# Altium schematic sheet bluetooth.SchDoc
size A4; SheetNumber: 4; SheetTotal: 8
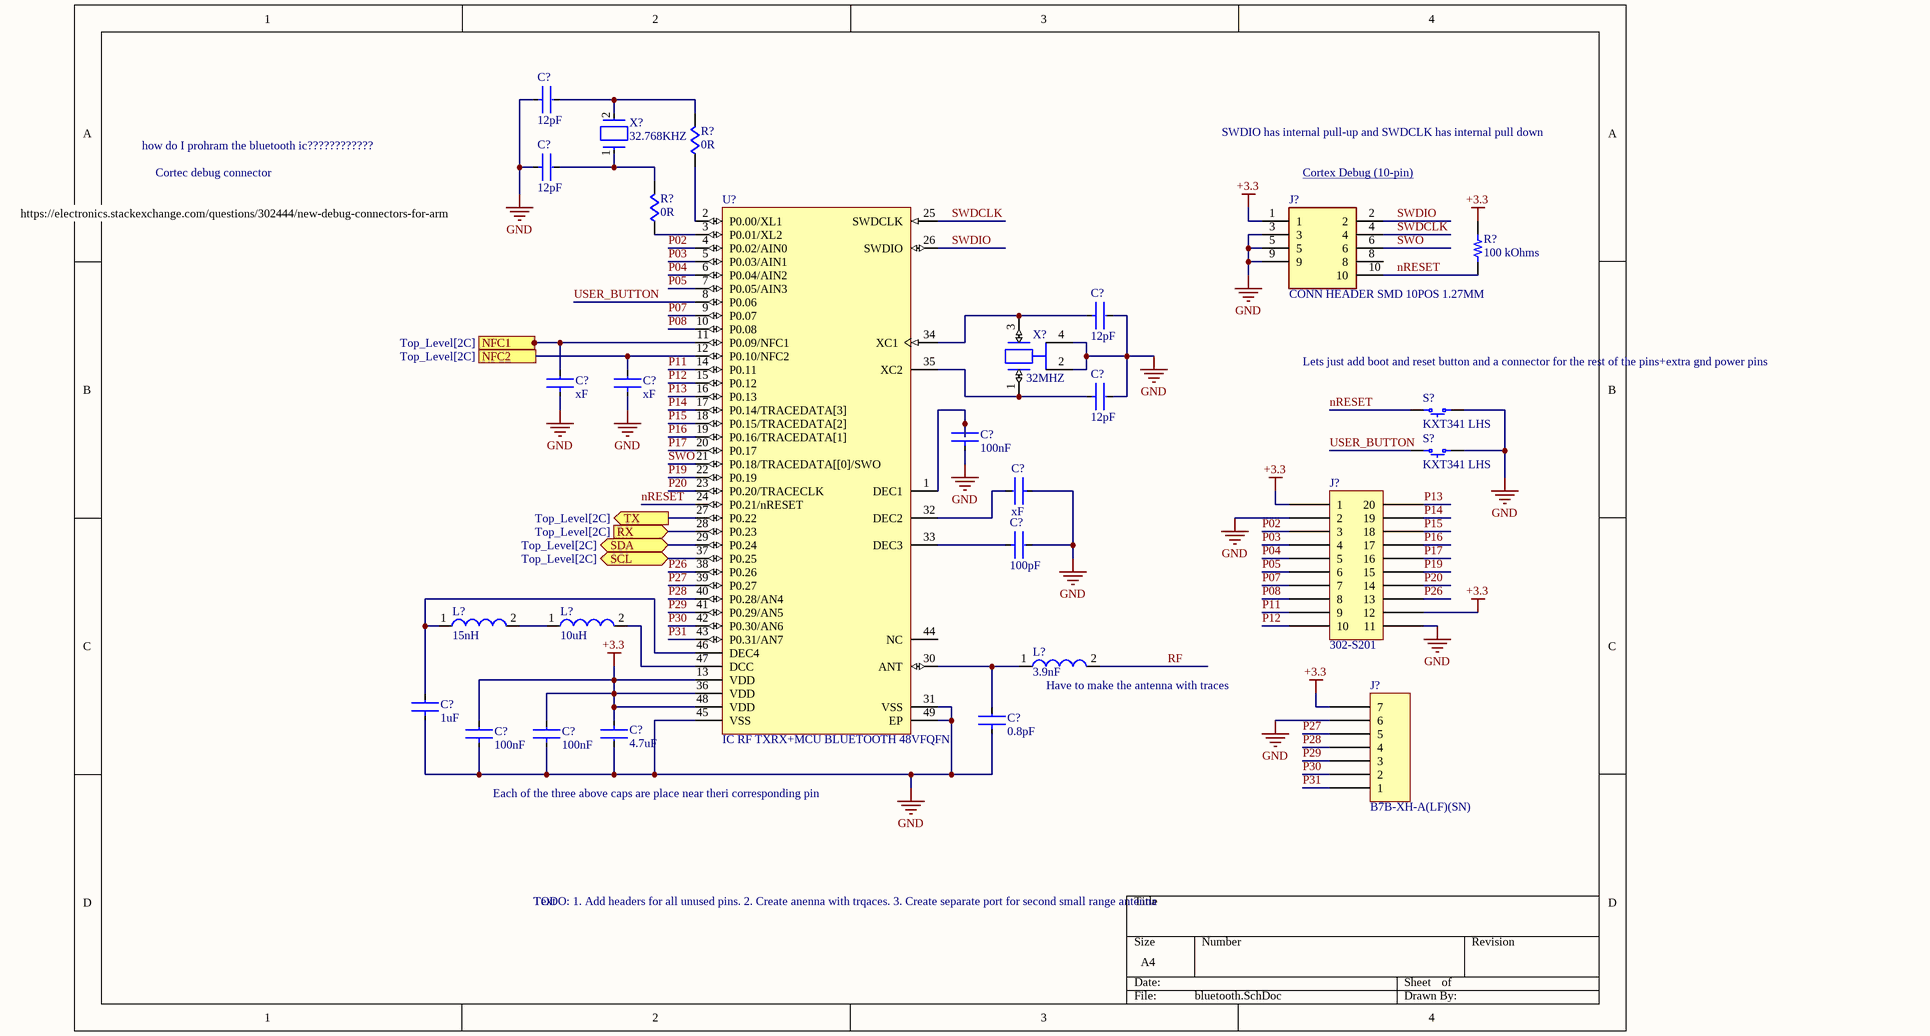
[diagram p0: bluetooth.SchDoc]

## Parts
(Parts that share a designator on the sheet are numbered #1, #2 ... from top to bottom, then left to right.)
C?#1  value 12pF  [FP-GCM155-0_05-IPC_C]  (hidden comment: NPO, +-2%)
C?#2  value 12pF  [FP-GCM155-0_05-IPC_C]  (hidden comment: NPO, +-2%)
C?#3  value 12pF  [FP-GCM155-0_05-IPC_C]  (hidden comment: NPO, +-2%)
C?#4  value xF  [FP-GCM155-0_05-IPC_C]  (hidden comment: tune)
C?#5  value xF  [FP-GCM155-0_05-IPC_C]  (hidden comment: tune)
C?#6  value 12pF  [FP-GCM155-0_05-IPC_C]  (hidden comment: NPO, +-2%)
C?#7  value 100nF  [FP-GCM155-0_05-IPC_C]  (hidden comment: X7R, +-10%)
C?#8  value xF  [FP-GCM155-0_05-IPC_C]  (hidden comment: tune)
C?#9  value 100pF  [FP-GCM155-0_05-IPC_C]  (hidden comment: NP0, +-5%)
C?#10  value 1uF  [FP-CGA3E-0_3-0_1-IPC_C]  (hidden comment: X7R, +-10%)
C?#11  value 0.8pF  [FP-GCM155-0_05-IPC_C]  (hidden comment: NP0, +-5%)
C?#12  value 100nF  [FP-GCM155-0_05-IPC_C]  (hidden comment: X7R, +-10%)
C?#13  value 100nF  [FP-GCM155-0_05-IPC_C]  (hidden comment: X7R, +-10%)
C?#14  value 4.7uF  [FP-CGA3E-0_3-0_1-IPC_C]  (hidden comment: X5R, +-10%)
J?#1  CONN HEADER SMD 10POS 1.27MM  [FTSH10501LDV007K]
J?#2  302-S201  [OST 302-S201]
J?#3  B7B-XH-A(LF)(SN)  [JST XH B7B-XH-A]
L?#1  value 15nH  [FP-LBMF1608-0_8-0_2-IPC_C]  (hidden comment: FIXED IND 15NH 500MA 500MOHM SMD)
L?#2  value 10uH  [FP-MLZ1608-IPC_C]  (hidden comment: FIXED IND 10UH 300MA 600MOHM SMD)
L?#3  value 3.9nF  (hidden comment: FIXED IND 3.9NH 200MA 750MOHM SM)
R?#1  value 0R  [FP-RK73Z1J-IPC_C]  (hidden comment: RES 0 OHM JUMPER 0603)
R?#2  value 0R  [FP-RK73Z1J-IPC_C]  (hidden comment: RES 0 OHM JUMPER 0603)
R?#3  100 kOhms  [RES 0402_1005]
S?#1  KXT341 LHS  [C&K KXT3]
S?#2  KXT341 LHS  [C&K KXT3]
U?  IC RF TXRX+MCU BLUETOOTH 48VFQFN
X?#1  value 32.768KHZ  [FP-ECX-34Q-MFG]  (hidden comment: ECS-.327-9-34QCS-TR)
X?#2  value 32MHZ  [FP-ECS-320-8-37CKM-MFG]  (hidden comment: CRYSTAL 32.0000MHZ 8PF SMD)

## Ports
NFC1 (see Top_Level[2C]), NFC2 (see Top_Level[2C]), RX (in, see Top_Level[2C]), SCL (bidir, see Top_Level[2C]), SDA (bidir, see Top_Level[2C]), TX (out, see Top_Level[2C])

## Nets
+3.3: C?#12.2 C?#13.2 C?#14.1 J?#1.1 J?#2.1 J?#2.12 J?#3.7 R?#3.2 U?.13(VDD) U?.36(VDD) U?.48(VDD)
GND: C?#1.1 C?#2.1 C?#3.2 C?#4.1 C?#5.1 C?#6.2 C?#7.1 C?#8.1 C?#9.2 C?#10.1 C?#11.1 C?#12.1 C?#13.1 C?#14.2 J?#1.3 J?#1.5 J?#1.9 J?#2.2 J?#2.11 J?#3.6 S?#1.1 S?#2.1 U?.31(VSS) U?.45(VSS) U?.49(EP) X?#2.2(Gnd) X?#2.4(Gnd)
NFC1: C?#4.2 U?.11(P0.09/NFC1) ; port NFC1
NFC2: C?#5.2 U?.12(P0.10/NFC2) ; port NFC2
nRESET: J?#1.10 R?#3.1 S?#1.2 U?.24(P0.21/nRESET)
P02: J?#2.3 U?.4(P0.02/AIN0)
P03: J?#2.4 U?.5(P0.03/AIN1)
P04: J?#2.5 U?.6(P0.04/AIN2)
P05: J?#2.6 U?.7(P0.05/AIN3)
P07: J?#2.7 U?.9(P0.07)
P08: J?#2.8 U?.10(P0.08)
P11: J?#2.9 U?.14(P0.11)
P12: J?#2.10 U?.15(P0.12)
P13: J?#2.20 U?.16(P0.13)
P14: J?#2.19 U?.17(P0.14/TRACEDATA[3])
P15: J?#2.18 U?.18(P0.15/TRACEDATA[2])
P16: J?#2.17 U?.19(P0.16/TRACEDATA[1])
P17: J?#2.16 U?.20(P0.17)
P19: J?#2.15 U?.22(P0.19)
P20: J?#2.14 U?.23(P0.20/TRACECLK)
P26: J?#2.13 U?.38(P0.26)
P27: J?#3.5 U?.39(P0.27)
P28: J?#3.4 U?.40(P0.28/AN4)
P29: J?#3.3 U?.41(P0.29/AN5)
P30: J?#3.2 U?.42(P0.30/AN6)
P31: J?#3.1 U?.43(P0.31/AN7)
RF: L?#3.2
RX: U?.28(P0.23) ; port RX
SCL: U?.37(P0.25) ; port SCL
SDA: U?.29(P0.24) ; port SDA
SWDCLK: J?#1.4 U?.25(SWDCLK)
SWDIO: J?#1.2 U?.26(SWDIO)
SWO: J?#1.6 U?.21(P0.18/TRACEDATA[[0]/SWO)
TX: U?.27(P0.22) ; port TX
USER_BUTTON: S?#2.2 U?.8(P0.06)
NetC?#1_2: C?#1.2 R?#1.2 X?#1.2(Out/In)
NetC?#2_2: C?#2.2 R?#2.2 X?#1.1(In/Out)
NetC?#3_1: C?#3.1 U?.34(XC1) X?#2.3(Out/In)
NetC?#6_1: C?#6.1 U?.35(XC2) X?#2.1(In/Out)
NetC?#7_2: C?#7.2 U?.1(DEC1)
NetC?#8_2: C?#8.2 U?.32(DEC2)
NetC?#9_1: C?#9.1 U?.33(DEC3)
NetC?#10_2: C?#10.2 L?#1.1 U?.46(DEC4)
NetC?#11_2: C?#11.2 L?#3.1 U?.30(ANT)
NetL?#1_2: L?#1.2 L?#2.1
NetL?#2_2: L?#2.2 U?.47(DCC)
NetR?#1_1: R?#1.1 U?.2(P0.00/XL1)
NetR?#2_1: R?#2.1 U?.3(P0.01/XL2)

Not connected (* = marked no-connect by the designer): J?#1 8; U? 44(NC)

## Notes on the sheet
- how do I prohram the bluetooth ic????????????
- Cortec debug connector
- SWDIO has internal pull-up and SWDCLK has internal pull down
- (near J?#1) Cortex Debug (10-pin) <https://developer.arm.com/documentation/101416/0100/Hardware-Description/Target-Interfaces/Cortex-Debug--10-pin->
- https://electronics.stackexchange.com/questions/302444/new-debug-connectors-for-arm
- (near S?#1) Lets just add boot and reset button and a connector for the rest of the pins+extra gnd power pins
- (near L?#3) Have to make the antenna with traces
- (near C?#14) Each of the three above caps are place near theri corresponding pin
- Text
- TODO: 1. Add headers for all unused pins. 2. Create anenna with trqaces. 3. Create separate port for second small range antenna

## Library data of the parts
C?#1-C?#9 C?#11-C?#13 = CAP 0402
C?#10 C?#14 = CAP 0603
J?#1 = FTSH-105-01-L-DV-007-K
J?#2 = 302-S201: CONN HEADER VERT 20POS 2.54MM; Manufacturer: On Shore Technology Inc.; Contact Length - Post: 0.122" (3.10mm); Current Rating (Amps): 3A; Material Flammability Rating: UL94 V-0; Number of Positions: 20; Number of Positions Loaded: All; Pitch - Mating: 0.100" (2.54mm); Shrouding: Shrouded - 4 Wall; Style: Board to Cable/Wire; Part Number: 302-S201; ComponentLink1Description: Datasheet; ComponentLink1URL: http://www.on-shore.com/wp-content/uploads/2018/04/302-SXX1.pdf; ComponentLink2Description: DigiKey Link; ComponentLink2URL: https://www.digikey.com/en/products/detail/on-shore-technology-inc/302-S201/2794235; Connector Type: Header; Contact Finish - Mating: Gold; Contact Finish - Post: Gold; Contact Finish Thickness - Mating: Flash; Contact Material: Brass; Contact Shape: Square; Contact Type: Male Pin; Fastening Type: Push-Pull; Features: Keying Slot; Insulation Color: Black; Insulation Height: 0.358" (9.10mm); Insulation Material: Polyester, Glass Filled; LastUpdated: 2022-08-14 5:03:46 PM; Lifecycle Status: Active; Minimum Order: 1; Mounting Type: Through Hole; Number of Rows: 2; Operating Temperature: -40°C ~ 105°C; Packaging: Tray; PartId: 155; Part Status: Active; Price: 0.19; Row Spacing - Mating: 0.100" (2.54mm); Series: 302; Supplier 1: DigiKey; Supplier Part Number 1: ED10524-ND; Termination: Solder
J?#3 = B7B-XH-A(LF)(SN): CONN HEADER VERT 7POS 2.5MM; Manufacturer: JST Sales America Inc.; Contact Length - Post: 0.134" (3.40mm); Current Rating (Amps): 3A; Material Flammability Rating: UL94 V-0; Number of Positions: 7; Number of Positions Loaded: All; Pitch - Mating: 0.098" (2.50mm); Shrouding: Shrouded - 4 Wall; Style: Board to Cable/Wire; Voltage Rating: 250V; Part Number: B7B-XH-A(LF)(SN); ComponentLink1Description: Datasheet; ComponentLink1URL: http://www.jst-mfg.com/product/pdf/eng/eXH.pdf; ComponentLink2Description: DigiKey Link; ComponentLink2URL: http://digikey.com/product-detail/en/jst-sales-america-inc/B7B-XH-A-LF-SN/455-2252-ND/1651050; Connector Type: Header; Contact Finish - Mating: Tin; Contact Finish - Post: Tin; Contact Material: Brass; Contact Shape: Square; Contact Type: Male Pin; Fastening Type: Detent Lock; Insulation Color: Natural; Insulation Height: 0.276" (7.00mm); Insulation Material: Polyamide (PA66), Nylon 6/6; LastUpdated: 2020-01-12 11:47:09 PM; Lifecycle Status: Active; Minimum Order: 1; Mounting Type: Through Hole; Number of Rows: 1; Operating Temperature: -25°C ~ 85°C; Packaging: Bulk; PartId: 72; Part Status: Active; Price: 0.33; Series: XH; Supplier 1: DigiKey; Supplier Part Number 1: 455-2252-ND; Termination: Press-Fit, Solder
L?#1 = 744786115A: Manufacturer: Wurth Electronics; Core Material: Ceramic; Inductance Tolerance: 5%; Shielding: Unshielded; DC Resistance (DCR): 500mR; Self Resonant Frequency: 2.3GHz; Test Frequency: 100MHz; Supplier: Digi-Key; Supplier Part Number: 732-6265-1-ND; Manufacturer Part Number: 744786115A; RoHS: Yes; Category: Fixed Inductors; Stock: 34669; Pricing: 1=0.21, 50=0.197, 100=0.185, 500=0.167, 1000=0.143, 2000=0.113 (USD); Mounting Technology: Surface Mount; Case/Package: 0603; Case Code (Metric): 1608; Case Code (Imperial): 0603; Min Operating Temperature: -55°C; Max Operating Temperature: 125°C; Packaging: Cut Tape; Current Rating: 500mA; Max DC Current: 500mA; Tolerance: 5%; Series: WE-MK; Length: 0.063inch; Width: 0.031inch; Height - Seated (Max): 0.037inch; RoHS Compliant: Yes; Reach SVHC Compliant: Unknown; ComponentLink1URL: http://www.farnell.com/datasheets/1818771.pdf?src-supplier=Farnell; ComponentLink1Description: http://www.farnell.com/datasheets/1818771.pdf?src-supplier=Farnell; ComponentLink2URL: http://www.farnell.com/datasheets/1818771.pdf?src-supplier=Element14; ComponentLink2Description: http://www.farnell.com/datasheets/1818771.pdf?src-supplier=Element14; ComponentLink3URL: https://katalog.we-online.de/pbs/datasheet/744786115A.pdf?src-supplier=Digi-Key; ComponentLink3Description: https://katalog.we-online.de/pbs/datasheet/744786115A.pdf?src-supplier=Digi-Key
L?#2 = MLZ1608N100LTD25: Manufacturer: TDK; Inductor Type: GENERAL PURPOSE INDUCTOR; Supplier: Digi-Key; Supplier Part Number: 445-17067-1-ND; Manufacturer Part Number: MLZ1608N100LTD25; RoHS: Yes; Category: Fixed Inductors; Stock: 118754; Pricing: 1=0.2, 10=0.177, 25=0.1576, 50=0.134, 100=0.1182, 250=0.10832, 500=0.09848, 1000=0.08272 (USD); Reach SVHC Compliant: Yes; RoHS Compliant: Yes; ComponentLink1URL: https://datasheet.ciiva.com:443/pdfs/VipMasterIC/IC/TDKC/TDKC-S-A0007713921/TDKC-S-A0007713921-1.pdf?src-supplier=IHS+Markit; ComponentLink1Description: https://datasheet.ciiva.com:443/pdfs/VipMasterIC/IC/TDKC/TDKC-S-A0007713921/TDKC-S-A0007713921-1.pdf?src-supplier=IHS+Markit; ComponentLink2URL: http://www.mouser.com/ds/2/400/nductor_commercial_decoupling_mlz1608_en-837720.pdf?src-supplier=Mouser; ComponentLink2Description: http://www.mouser.com/ds/2/400/nductor_commercial_decoupling_mlz1608_en-837720.pdf?src-supplier=Mouser; ComponentLink3URL: https://product.tdk.com/info/en/catalog/datasheets/inductor_automotive_decoupling_mlz1608_en.pdf?src-supplier=Digi-Key; ComponentLink3Description: https://product.tdk.com/info/en/catalog/datasheets/inductor_automotive_decoupling_mlz1608_en.pdf?src-supplier=Digi-Key; ComponentLink4URL: http://product.tdk.com/inductor/ind/en/documents/inductor_automotive_decoupling_mlz_en.pdf?src-supplier=Digi-Key; ComponentLink4Description: http://product.tdk.com/inductor/ind/en/documents/inductor_automotive_decoupling_mlz_en.pdf?src-supplier=Digi-Key
L?#3 = MHQ0402PSA3N9BT000: Manufacturer: TDK; Inductor Type: GENERAL PURPOSE INDUCTOR; Supplier: Digi-Key; Supplier Part Number: 445-174653-1-ND; Manufacturer Part Number: MHQ0402PSA3N9BT000; RoHS: Yes; Category: Fixed Inductors; Stock: 16837; Pricing: 1=0.1, 10=0.086, 25=0.0768, 50=0.0652, 100=0.0576, 250=0.05276, 500=0.04798, 1000=0.0403, 2500=0.03454 (USD); Reach SVHC Compliant: Yes; RoHS Compliant: Yes; ComponentLink1URL: https://datasheet.ciiva.com:443/pdfs/VipMasterIC/IC/TDKC/TDKC-S-A0007109881/TDKC-S-A0007109881-1.pdf?src-supplier=IHS+Markit; ComponentLink1Description: https://datasheet.ciiva.com:443/pdfs/VipMasterIC/IC/TDKC/TDKC-S-A0007109881/TDKC-S-A0007109881-1.pdf?src-supplier=IHS+Markit; ComponentLink2URL: https://product.tdk.com/info/en/catalog/datasheets/inductor_commercial_high-frequency_mhq0402psa_en.pdf?src-supplier=Digi-Key; ComponentLink2Description: https://product.tdk.com/info/en/catalog/datasheets/inductor_commercial_high-frequency_mhq0402psa_en.pdf?src-supplier=Digi-Key
R?#1 R?#2 = RK73Z1JTTD: Manufacturer: KOA Speer; Rated Temperature: 70°C; Package Height: 0.45mm; Package Length: 1.6mm; Package Width: 0.8mm; Reference Standard: AEC-Q200; Supplier: Digi-Key; Supplier Part Number: 2019-RK73Z1JTTDCT-ND; Manufacturer Part Number: RK73Z1JTTD; RoHS: Yes; Category: Chip SMD Resistors; Stock: 8562065; Pricing: 1=0.1, 10=0.016, 50=0.0088, 100=0.0065, 500=0.00396, 1000=0.00292 (USD); Mounting Technology: Surface Mount; Pins: 2; Case/Package: 0603; Terminal Finish: Nickel; Min Operating Temperature: -55°C; Max Operating Temperature: 155°C; JESD-609 Code: e3; Resistor Type: FIXED RESISTOR; Construction: Rectangular; Package Style: SMTMeter; Packaging: Tape and Reel; Termination: Wraparound; Reach SVHC Compliant: Yes; RoHS Compliant: Yes; ComponentLink1URL: https://datasheet.ciiva.com:443/pdfs/VipMasterIC/IC/KOAS/KOAS-S-A0009586251/KOAS-S-A0009586308-1.pdf?src-supplier=IHS+Markit; ComponentLink1Description: https://datasheet.ciiva.com:443/pdfs/VipMasterIC/IC/KOAS/KOAS-S-A0009586251/KOAS-S-A0009586308-1.pdf?src-supplier=IHS+Markit; ComponentLink2URL: https://datasheet.ciiva.com/7816/549012-7816884.pdf?src-supplier=Element14; ComponentLink2Description: https://datasheet.ciiva.com/7816/549012-7816884.pdf?src-supplier=Element14; ComponentLink3URL: https://datasheet.ciiva.com/26914/getdatasheetpartid-123499-26914653.pdf?src-supplier=Verical; ComponentLink3Description: https://datasheet.ciiva.com/26914/getdatasheetpartid-123499-26914653.pdf?src-supplier=Verical
R?#3 = AC0402JR-07100KL: RES SMD 100K OHM 5% 1/16W 0402; Manufacturer: Yageo; Power (Watts): 0.063W, 1/16W; Temperature Coefficient: ±100ppm/°C; Part Number: AC0402JR-07100KL; Value: 100 kOhms; ComponentLink1Description: Datasheet; ComponentLink1URL: https://www.yageo.com/upload/media/product/productsearch/datasheet/rchip/PYu-AC_51_RoHS_L_7.pdf; ComponentLink2Description: DigiKey Link; ComponentLink2URL: https://www.digikey.com/en/products/detail/yageo/AC0402JR-07100KL/5895569; Composition: Thick Film; Device Package: 0402 (1005 Metric); Features: Automotive AEC-Q200, Moisture Resistant; Height - Seated (Max): 0.015" (0.37mm); LastUpdated: 2023-06-08 7:32:26 PM; Lifecycle Status: Active; Minimum Order: 1; Number of Terminations: 2; Operating Temperature: -55°C ~ 155°C; Package / Case: 0402 (1005 Metric); Packaging: CutTape; PartId: 3380; Part Status: Active; Price: 0.01; Ratings: AEC-Q200; Resistance: 100 kOhms; Series: AC; Size / Dimension: 0.039" L x 0.020" W (1.00mm x 0.50mm); Supplier 1: DigiKey; Supplier Part Number 1: YAG3515CT-ND; Supplier Device Package: 0402; Tolerance: ±5%
S?#1 S?#2 = KXT341 LHS: SWITCH TACTILE SPST-NO 0.02A 15V; Manufacturer: C&K; Actuator Height off PCB, Vertical: 0.60mm; Actuator Orientation: Top Actuated; Actuator Type: Standard; Contact Rating @ Voltage: 0.02A @ 15VDC; Illumination: Non-Illuminated; Operating Force: 330gf; Outline: 3.00mm x 2.00mm; Switch Function: Off-Mom; Part Number: KXT341 LHS; Circuit: SPST-NO; ComponentLink1Description: Datasheet; ComponentLink1URL: https://dznh3ojzb2azq.cloudfront.net/products/Tactile/KXT3/documents/datasheet.pdf; ComponentLink2Description: DigiKey Link; ComponentLink2URL: https://www.digikey.com/en/products/detail/c-k/KXT341-LHS/6607322; LastUpdated: 2023-06-04 8:46:36 PM; Lifecycle Status: Active; Minimum Order: 1; Mounting Type: Surface Mount; Operating Temperature: -40°C ~ 85°C; Packaging: TapeAndReel; Part Status: Active; Price: 0.13; Series: KXT3; Supplier 1: DigiKey; Supplier Part Number 1: CKN10781CT-ND; Termination Style: SMD (SMT) Tab
U? = NRF52832-QFAA-R: Manufacturer: Nordic Semiconductor; Channels: 1; Nominal Supply Voltage: 3V; Telecom IC Type: TELECOM CIRCUIT; Supplier: Digi-Key; Supplier Part Number: 4823-NRF52832-QFAA-RCT-ND; Manufacturer Part Number: NRF52832-QFAA-R; RoHS: Yes; Category: RF Receivers, Transceivers; Stock: 373904; Pricing: 1=5.81, 10=5.189, 25=4.67, 100=4.2547, 250=3.83964, 500=3.4453, 1000=2.90567 (USD); Case/Package: HVQCCN; Pins: 48; Package Shape: Square; Min Operating Temperature: -40°C; Max Operating Temperature: 85°C; JESD-30 Code: S-XQCC-N48; Package Style: CHIP CARRIER, HEAT SINK/SLUG, VERY THIN PROFILEMeter; Surface Mount: Yes; Terminal Form: No Lead; Terminal Position: QUAD; Length: 6mm; Width: 6mm; Height - Seated (Max): 0.95mm; Terminal Pitch: 0.4mm; Temperature Grade: INDUSTRIAL; Reach SVHC Compliant: Yes; RoHS Compliant: Yes; ComponentLink1URL: https://datasheet.ciiva.com:443/pdfs/VipMasterIC/IC/NRSA/NRSA-S-A0002414264/NRSA-S-A0002414264-1.pdf?src-supplier=IHS+Markit; ComponentLink1Description: https://datasheet.ciiva.com:443/pdfs/VipMasterIC/IC/NRSA/NRSA-S-A0002414264/NRSA-S-A0002414264-1.pdf?src-supplier=IHS+Markit; ComponentLink2URL: http://www.mouser.com/ds/2/297/nRF52832%20Product%20Brief%20v1.2-890472.pdf?src-supplier=Mouser; ComponentLink2Description: http://www.mouser.com/ds/2/297/nRF52832%20Product%20Brief%20v1.2-890472.pdf?src-supplier=Mouser; ComponentLink3URL: http://infocenter.nordicsemi.com/pdf/nRF52832_PB_v1.7.pdf?src-supplier=Digi-Key; ComponentLink3Description: http://infocenter.nordicsemi.com/pdf/nRF52832_PB_v1.7.pdf?src-supplier=Digi-Key; ComponentLink4URL: http://infocenter.nordicsemi.com/pdf/nRF52832_PS_v1.4.pdf?src-supplier=Digi-Key; ComponentLink4Description: http://infocenter.nordicsemi.com/pdf/nRF52832_PS_v1.4.pdf?src-supplier=Digi-Key
X?#1 = ECS-.327-9-34QCS-TR: CRYSTAL 32.768KHZ 9PF SMD; Manufacturer: ECS International; Supplier: Digi-Key; Supplier Part Number: XC2160CT-ND; Manufacturer Part Number: ECS-.327-9-34QCS-TR; RoHS: Yes; Category: Crystals; Stock: 10283; Pricing: 1=1.12, 10=0.99, 50=0.9252, 100=0.8175, 500=0.7745, 1000=0.64542 (USD); ComponentLink1URL: http://www.ecsxtal.com/store/pdf/partnumber4.pdf?src-supplier=Digi-Key; ComponentLink1Description: http://www.ecsxtal.com/store/pdf/partnumber4.pdf?src-supplier=Digi-Key; ComponentLink2URL: https://www.ecsxtal.com/store/pdf/ECX-34Q.pdf?src-supplier=Digi-Key; ComponentLink2Description: https://www.ecsxtal.com/store/pdf/ECX-34Q.pdf?src-supplier=Digi-Key
X?#2 = ECS-320-8-37CKM: Manufacturer: ECS International; Supplier: Digi-Key; Supplier Part Number: XC1547CT-ND; Manufacturer Part Number: ECS-320-8-37CKM; RoHS: Yes; Category: Crystals; Stock: 683720; Pricing: 1=0.92, 10=0.813, 50=0.76, 100=0.6716, 500=0.63624 (USD); ComponentLink1URL: https://datasheet.ciiva.com/854/ecx-1637-854098.pdf?src-supplier=Digi-Key; ComponentLink1Description: https://datasheet.ciiva.com/854/ecx-1637-854098.pdf?src-supplier=Digi-Key; ComponentLink2URL: https://datasheet.ciiva.com/854/ecx-1637-854099.pdf?src-supplier=Digi-Key; ComponentLink2Description: https://datasheet.ciiva.com/854/ecx-1637-854099.pdf?src-supplier=Digi-Key; ComponentLink3URL: https://datasheet.ciiva.com/854/ecx-1637-854100.pdf?src-supplier=Digi-Key; ComponentLink3Description: https://datasheet.ciiva.com/854/ecx-1637-854100.pdf?src-supplier=Digi-Key